# EAGLE design MyPO (EAGLE 7.1.0)
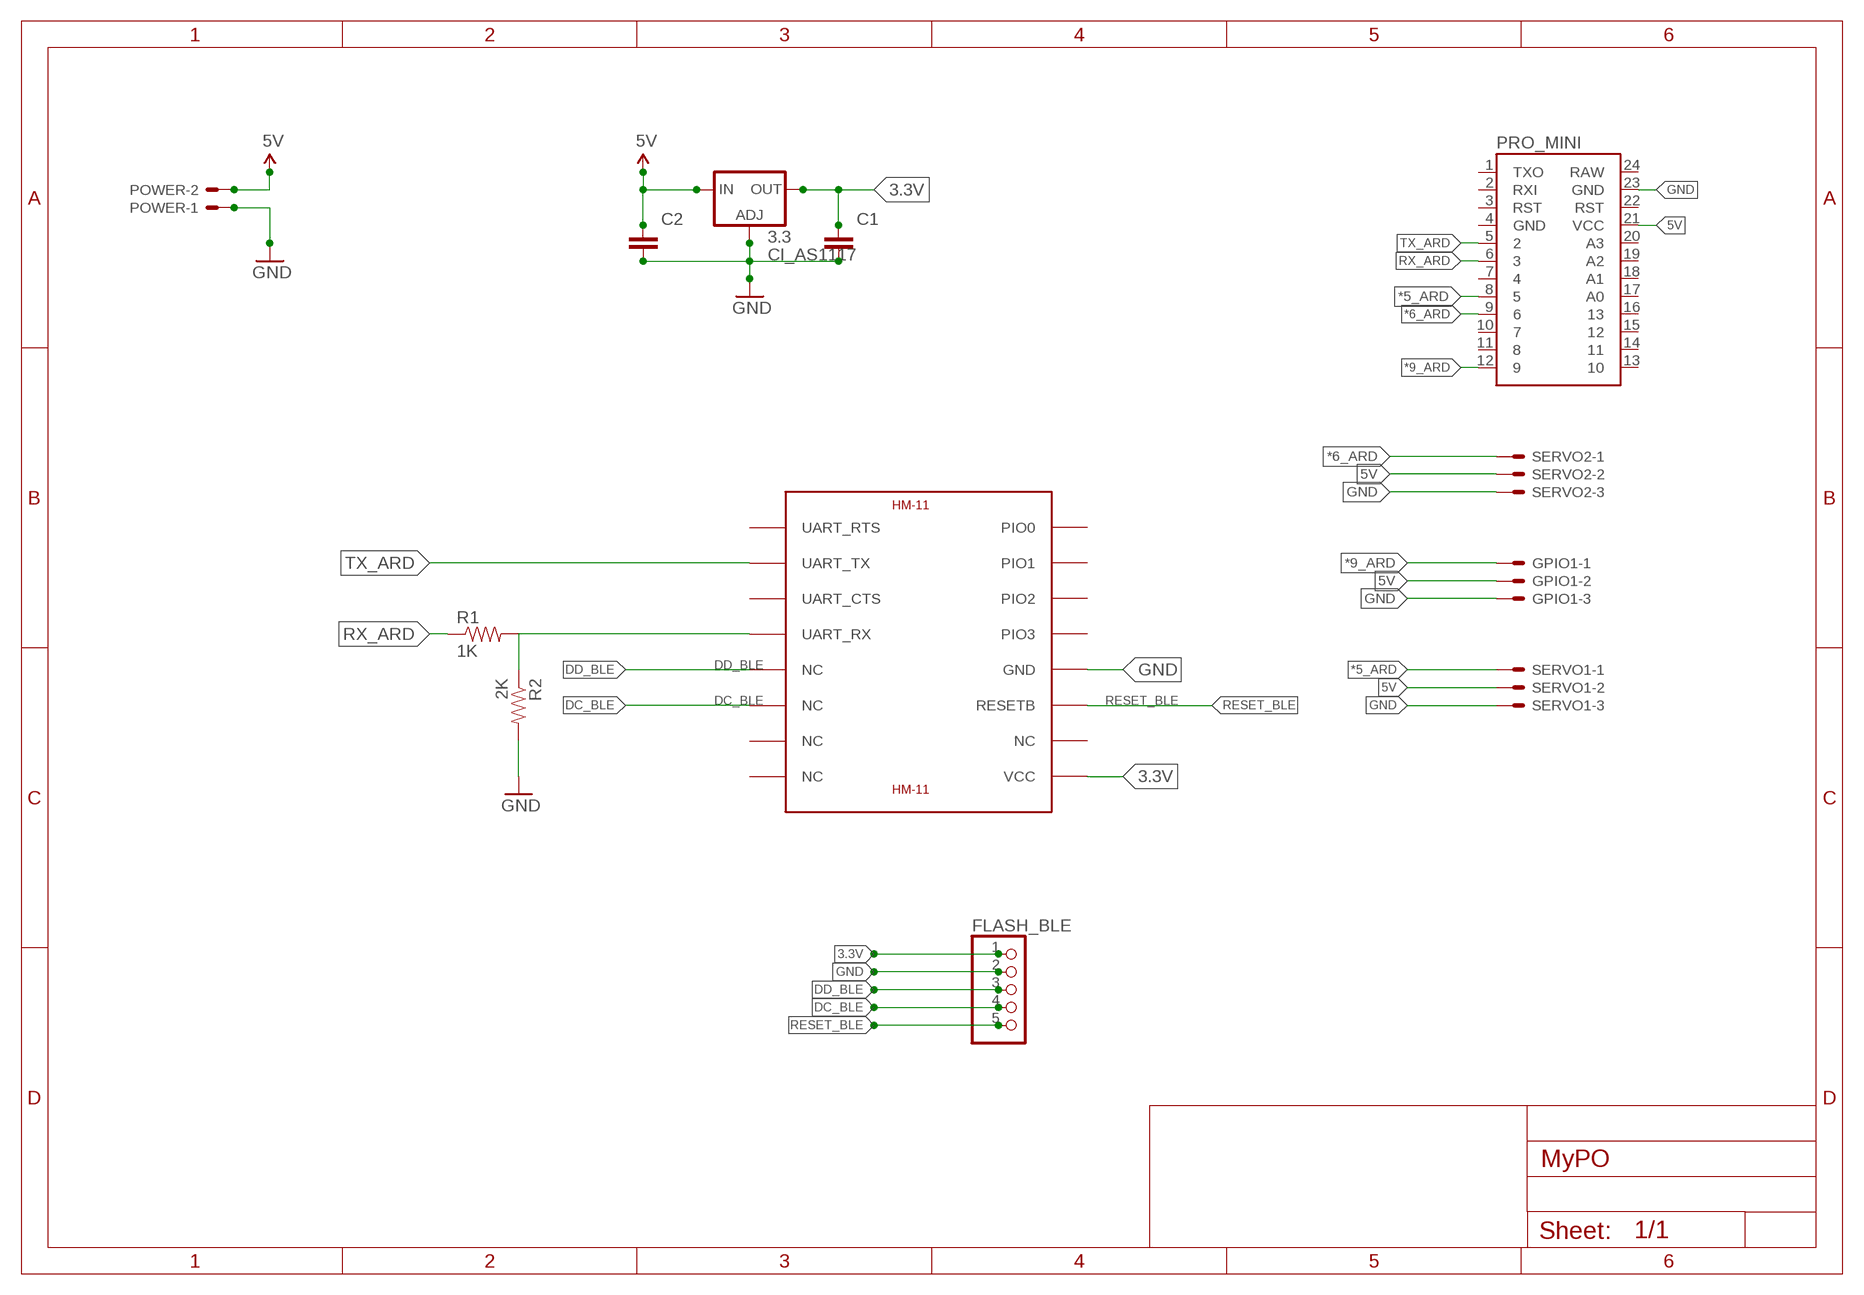
[diagram p0: schematic, sheet 1]

## Parts
3.3  CI_AS1117  LD117ADT-TR  [DPACK]
BLE  HM-11  [HM-11]
C1  CAPACITOR-0805  [C0805]
C2  CAPACITOR-0805  [C0805]
FLASH_BLE  PINHD-1X55X2MM  [1_05X2MM]
GPIO1  JST-XH-03-PIN-LONG-PAD  [JST-XH-03-PACKAGE-LONG-PAD]
POWER  JST-XH-02-PIN-LONG-PAD  [JST-XH-02-PACKAGE-LONG-PAD]
PRO_MINI  ARDUINO_MINI  [ARDUINO_MINI]
R1  1K  RESISTOR-0805  [R0805]
R2  2K  RESISTOR-0805  [R0805]
SERVO1  JST-XH-03-PIN-LONG-PAD  [JST-XH-03-PACKAGE-LONG-PAD]
SERVO2  JST-XH-03-PIN-LONG-PAD  [JST-XH-03-PACKAGE-LONG-PAD]

## Nets
3.3V: 3.3.4(OUT) BLE.VCC C1.1 FLASH_BLE.1
5V: 3.3.3(IN) C2.1 GPIO1.2 POWER.2 PRO_MINI.21(VCC) SERVO1.2 SERVO2.2
*5_ARD: PRO_MINI.8 SERVO1.1
*6_ARD: PRO_MINI.9 SERVO2.1
*9_ARD: GPIO1.1 PRO_MINI.12
DC_BLE: BLE.NC@6(NC) FLASH_BLE.4
DD_BLE: BLE.NC@5(NC) FLASH_BLE.3
GND: 3.3.1(ADJ) BLE.GND C1.2 C2.2 FLASH_BLE.2 GPIO1.3 POWER.1 PRO_MINI.23(GND) R2.2 SERVO1.3 SERVO2.3
N$1: BLE.UART_RX R1.2 R2.1
RESET_BLE: BLE.RESETB FLASH_BLE.5
RX_ARD: PRO_MINI.6 R1.1
TX_ARD: BLE.UART_TX PRO_MINI.5
Unconnected: BLE.NC@7(NC) BLE.NC@8(NC) BLE.NC@10(NC) BLE.PIO0 BLE.PIO1 BLE.PIO2 BLE.PIO3 BLE.UART_CTS BLE.UART_RTS PRO_MINI.1(TXO) PRO_MINI.2(RXI) PRO_MINI.3(RST) PRO_MINI.4(GND) PRO_MINI.7 PRO_MINI.10 PRO_MINI.11 PRO_MINI.13 PRO_MINI.14 PRO_MINI.15 PRO_MINI.16 PRO_MINI.17(A0) PRO_MINI.18(A1) PRO_MINI.19(A2) PRO_MINI.20(A3) PRO_MINI.22(RST) PRO_MINI.24(RAW)

## Library data of the parts
3.3 = v-reg:LD117A?*: Low drop fixed and adjustable positive voltage regulators 1 A Source: http://www.st.com/stonline/products/literature/ds/7194/ld1117axx.pdf
BLE = HM-11:HM-11: JNHuaMao HM-11 Bluetooth 4.0 Transceiver based on TI CC2540/CC2541
C1 C2 = gary:CAPACITOR: Non-Polarized capacitor in various packages
FLASH_BLE = pinhead:PINHD-1X5: PIN HEADER
GPIO1 SERVO1 SERVO2 = Rembrandt Electronics - JST XH Connectors v1-0:JST-XH-03-PIN: JST XH Connector 2 Pin Wire to board connector. Pitch: 2,54 mm, (0.100") Number of pins: 3 Created by Rembrandt Electronics www.rembrandtelectronics.com
POWER = Rembrandt Electronics - JST XH Connectors v1-0:JST-XH-02-PIN: JST XH Connector 2 Pin Wire to board connector. Pitch: 2,54 mm, (0.100") Number of pins: 2 Created by Rembrandt Electronics www.rembrandtelectronics.com
PRO_MINI = SparkFun-Boards:ARDUINO_MINI: Arduino Pro Mini footprint
R1 R2 = gary:RESISTOR: Resistor Basic schematic elements and footprints for 0603, 1206, and PTH resistors.

## Board
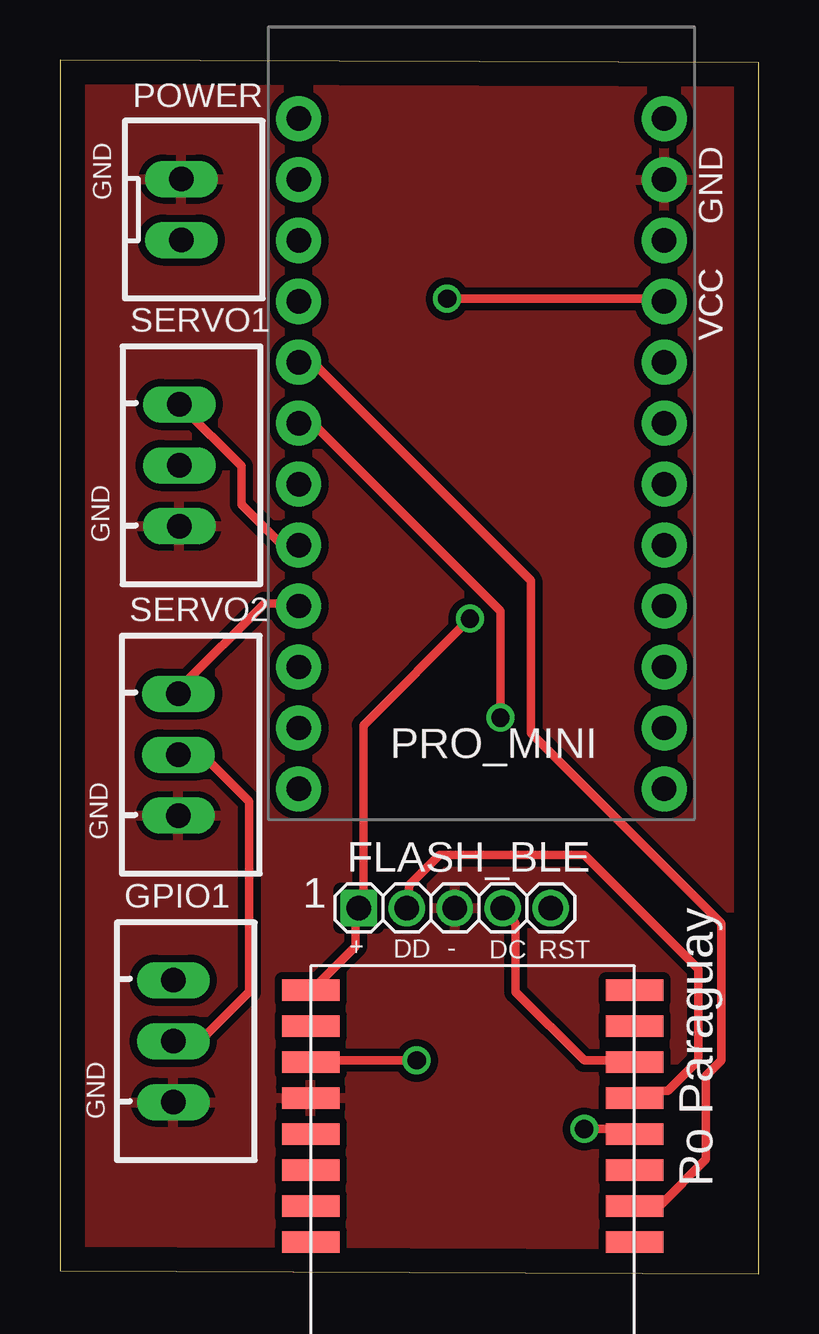
[diagram p1: board, top side]
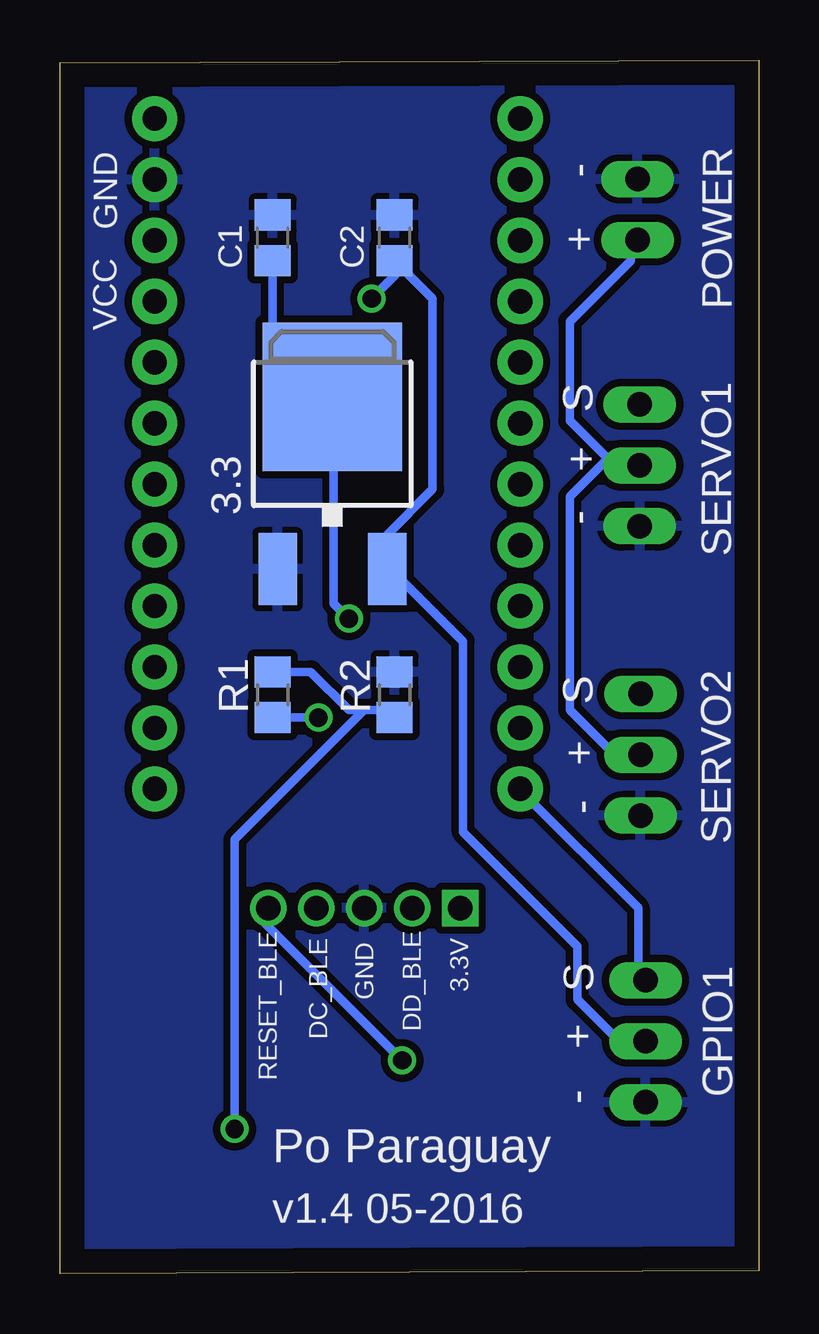
[diagram p2: board, bottom side, seen from below]

Size 29.14 x 50.59 mm. Coordinates in mm from the lower left corner, seen from the top.
Outline: 0,0.12 29.14,0 29.14,50.47 0,50.59 0,0.12
Copper layers (1*16): Top 0.035mm / dielectric 1.5mm / Bottom 0.035mm
Design rules "default *": minimum track width 14mil, minimum drill 30mil, track to track 12mil, track to pad 12mil, pad to pad 12mil, via to via 12mil, smd to smd 12mil, copper to edge 40mil, drill to drill 15mil, minimum pad ring 10mil, minimum via ring 8mil, stop-mask expansion 4mil, vias tented up to drill 0mil, thermal gap 10mil

### Footprints (pad centres in the part's own frame; a part is rotated, then mirrored left to right if it is on the bottom)
DPACK = smd 1.6 x 3: 1 -2.28,-4.8; 3 2.28,-4.8 | smd 5.8 x 6.2: 4 0,2.38
HM-11 = smd 2.4 x 0.9: GND 6.5,0; NC@5 -7,0; NC@6 -7,-1.5; NC@7 -7,-3; NC@8 -7,-4.5; NC@10 6.5,-3; PIO0 6.5,6; PIO1 6.5,4.5; PIO2 6.5,3; PIO3 6.5,1.5; RESETB 6.5,-1.5; UART_CTS -7,3; UART_RTS -7,6; UART_RX -7,1.5; UART_TX -7,4.5; VCC 6.5,-4.5
C0805 = smd 1.3 x 1.5: 1 -0.95,0; 2 0.95,0
1_05X2MM = drill 1.016 pad 1.3 square: 1 -4,0 | drill 1.016 pad 1.3: 2 0,0; 3 -2,0; 4 2,0; 5 4,0
JST-XH-03-PACKAGE-LONG-PAD = drill 1.016 long: 1 -2.54,0; 2 0,0; 3 2.54,0
JST-XH-02-PACKAGE-LONG-PAD = drill 1.016 long: 1 -1.27,0; 2 1.27,0
ARDUINO_MINI = drill 1.016 pad 1.88: 1 -7.62,12.7; 2 -7.62,10.16; 3 -7.62,7.62; 4 -7.62,5.08; 5 -7.62,2.54; 6 -7.62,0; 7 -7.62,-2.54; 8 -7.62,-5.08; 9 -7.62,-7.62; 10 -7.62,-10.16; 11 -7.62,-12.7; 12 -7.62,-15.24; 13 7.62,-15.24; 14 7.62,-12.7; 15 7.62,-10.16; 16 7.62,-7.62; 17 7.62,-5.08; 18 7.62,-2.54; 19 7.62,0; 20 7.62,2.54; 21 7.62,5.08; 22 7.62,7.62; 23 7.62,10.16; 24 7.62,12.7
R0805 = smd 1.3 x 1.5: 1 -0.95,0; 2 0.95,0

### Placement (x,y rotation side)
3.3  17.78,34.17 0 bottom
BLE  16.95,7.32 180 top
C1  20.27,43.18 90 bottom
C2  15.19,43.18 90 bottom
FLASH_BLE  16.46,15.24 0 top
GPIO1  4.73,9.69 270 top
POWER  5.06,44.36 270 top
PRO_MINI  17.57,35.45 0 top
R1  20.27,24.13 90 bottom
R2  15.19,24.13 90 bottom
SERVO1  4.97,33.7 270 top
SERVO2  4.94,21.63 270 top

### Tracks (layer width: path | path; a pad name or v marks a point on that pad's centre or on a via)
3.3V  (via drill 0.76)
  Top 0.356: BLE.VCC 10.74,12.07 12.33,13.65 12.33,15.24 FLASH_BLE.1 12.65,15.24 12.65,22.86 v17.09,27.3
  Bottom 0.356: C1.1 20.27,39.05 18.05,36.83 3.3.4 17.73,36.51 17.73,27.94 v17.09,27.3
5V  (via drill 0.76)
  Top 0.356: v16.14,40.64 25.03,40.64 PRO_MINI.21 | GPIO1.2 5.03,9.84 5.98,9.84 7.89,11.75 7.89,19.68 5.98,21.59 5.03,21.59 SERVO2.2
  Bottom 0.356: 14.87,41.91 13.6,40.64 13.6,32.7 15.51,30.8 15.51,29.53 3.3.3 15.19,29.21 12.33,26.35 12.33,18.41 7.57,13.65 7.57,11.43 5.98,9.84 5.03,9.84 GPIO1.2 | 14.87,41.91 C2.1 14.87,41.91 | 14.87,41.91 v16.14,40.64 | 6.3,33.97 5.03,33.97 SERVO1.2 6.3,33.97 | 6.3,33.97 7.89,35.56 7.89,39.69 5.35,42.23 5.35,42.86 POWER.2 | 6.3,33.97 7.89,32.38 7.89,23.5 6.3,21.91 5.03,21.91 SERVO2.2
*5_ARD
  Top 0.356: SERVO1.1 5.03,36.2 7.57,33.65 7.57,32.07 9.16,30.48 9.79,30.48 PRO_MINI.8
*6_ARD
  Top 0.356: SERVO2.1 5.03,24.45 8.52,27.94 9.79,27.94 PRO_MINI.9
*9_ARD
  Bottom 0.356: GPIO1.1 5.03,12.38 5.03,15.24 9.79,20 PRO_MINI.12
DC_BLE
  Top 0.356: BLE.NC@6 23.76,8.89 21.86,8.89 19,11.75 19,14.61 18.36,15.24 FLASH_BLE.4
DD_BLE
  Top 0.356: BLE.NC@5 24.08,7.62 25.35,7.62 26.62,8.89 26.62,12.7 21.86,17.46 15.82,17.46 14.55,16.19 14.55,15.24 FLASH_BLE.3
GND
  pour Bottom: -0.05,50.8 -0.19,-0.11 29.44,0.26 29.16,50.8
  pour Top: -0.05,50.8 -0.28,-0.04 29.37,-0.18 29.16,50.8
N$1  (via drill 0.76)
  Top 0.356: v21.86,6.03 23.76,6.03 BLE.UART_RX
  Bottom 0.356: 16.46,23.5 17.09,23.5 18.68,25.08 R1.2 | 16.46,23.5 15.19,23.5 R2.1 | v21.86,6.03 21.86,18.1 16.46,23.5
RESET_BLE  (via drill 0.76)
  Top 0.356: v14.87,8.89 10.74,8.89 BLE.RESETB
  Bottom 0.356: v14.87,8.89 20.59,14.61 20.59,15.24 FLASH_BLE.5
RX_ARD  (via drill 0.76)
  Top 0.356: v18.36,23.18 18.36,27.62 10.74,35.24 10.11,35.24 PRO_MINI.6
  Bottom 0.356: v18.36,23.18 R1.1
TX_ARD
  Top 0.356: BLE.UART_TX 24.08,2.86 25.03,2.86 26.94,4.76 26.94,8.26 27.57,8.89 27.57,14.61 19.63,22.54 19.63,28.89 10.74,37.78 10.11,37.78 PRO_MINI.5

### Text on the board
tNames: GND | GND | VCC | VCC | GND | GND | 1 | Po Paraguay | + | DD | - | DC | RST | GND
bNames: POWER | - | GND | + | VCC | SERVO1 | S | + | - | S | + | - | SERVO2 | DD_BLE | RESET_BLE | 3.3V | GND | DC_BLE | S | + | GPIO1 | - | Po Paraguay | v1.4 05-2016